# EAGLE design drawdio2 (EAGLE 5.01)
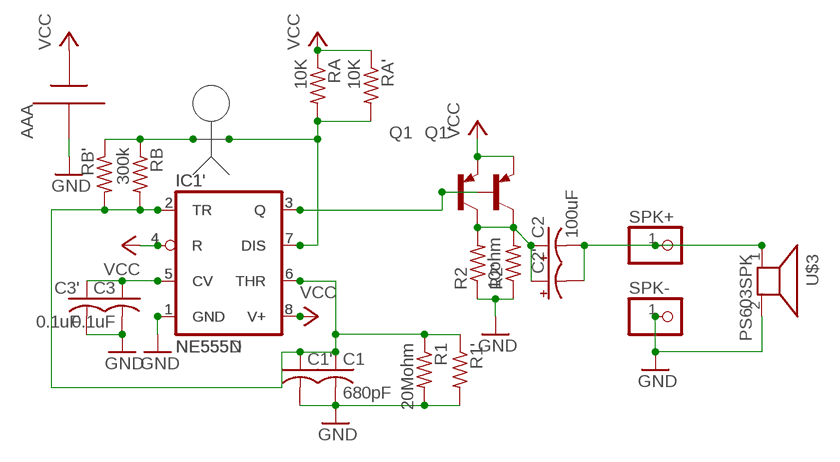
[diagram p0: schematic, sheet 1]

## Parts
AAA  AAA  [12BH412]
C1  680pF  C-US025-025X050  [C025-025X050]
C1'  C-USC1206  [C1206]
C2  100uF  CPOL-USE2.5-5  [E2,5-5]
C2'  CPOL-USB/3528-21W  [B/3528-21W]
C3  0.1uF  C-US025-025X050  [C025-025X050]
C3'  0.1uF  C-USC1206  [C1206]
IC1  NE555N  [DIL08]
IC1'  NE555D  [SO08]
Q1  MPS2907A-PNP-TO92-CBE  [TO92-CBE]
Q1'  MMBT2907ALT1-PNP-SOT23-BEC  [SOT23-BEC]
R1  20Mohm  R-US_0207/10  [0207/10]
R1'  R-US_R1206  [R1206]
R2  10ohm  R-US_0207/10  [0207/10]
R2'  R-US_M1206  [M1206]
RA  10K  R-US_0207/10  [0207/10]
RA'  10K  R-US_R1206  [R1206]
RB  300k  R-US_0207/10  [0207/10]
RB'  R-US_M1206  [M1206]
SPK+  PINHD-1X1  [1X01]
SPK-  PINHD-1X1  [1X01]
U$3  PS603SPK  [PS603]

## Nets
GND: AAA.- C1'.2 C1.2 C3'.2 C3.2 IC1'.1(GND) IC1.1(GND) R1'.2 R1.2 R2'.1 R2.1 SPK-.1 U$3.2
N$1: C3'.1 C3.1 IC1'.5(CV) IC1.5(CV)
N$2: IC1'.3(Q) IC1.3(Q) Q1'.B Q1.B
N$3: C2'.+ C2.+ Q1'.C Q1.C R2'.2 R2.2
N$4: C1'.1 C1.1 IC1'.2(TR) IC1'.6(THR) IC1.2(TR) IC1.6(THR) R1'.1 R1.1 RB'.2 RB.2
N$5: RB'.1 RB.1
N$6: IC1'.7(DIS) IC1.7(DIS) RA'.2 RA.2
N$7: C2'.- C2.- SPK+.1 U$3.1
VCC: AAA.+ IC1'.4(R) IC1'.8(V+) IC1.4(R) IC1.8(V+) Q1'.E Q1.E RA'.1 RA.1

## Library data of the parts
AAA = drawdio:AAA
C1 C1' C3 C3' = rcl-ez:C-US: CAPACITOR, American symbol
C2 C2' = rcl-ez:CPOL-US: POLARIZED CAPACITOR, American symbol
IC1 IC1' = drawdio:*555: TIMER
Q1 Q1' = transistor:*-PNP-: PNP Transistror
R1 R1' R2 R2' RA RA' RB RB' = rcl-ez:R-US_: RESISTOR, American symbol
SPK+ SPK- = ybox2:PINHD-1X1: PIN HEADER
U$3 = drawdio:PS603

## Board
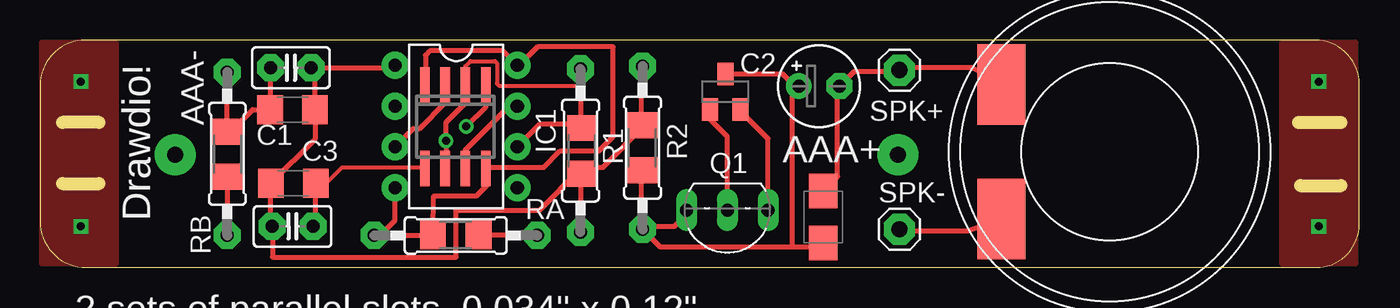
[diagram p1: board, top side]
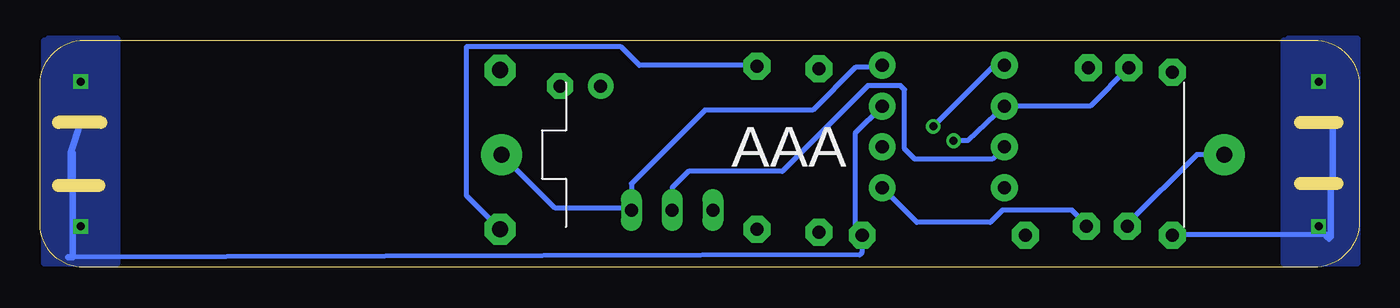
[diagram p2: board, bottom side, seen from below]

Size 82.15 x 14.15 mm. Coordinates in mm from the lower left corner, seen from the top.
Outline: 3.68,9.03 1.39,9.03
Outline: 1.39,5.22 3.68,5.22
Outline: 78.35,9.03 81.02,9.03
Outline: 78.48,5.09 81.02,5.09
Outline: 82.15,11.4 arc90 79.4,14.15 2.83,14.15 arc90 0,11.32 0,2.86 arc90 2.86,0 79.45,0 arc90 82.15,2.7 82.15,11.4
Copper layers (1*16): Top 0.035mm / dielectric 1.5mm / Bottom 0.035mm
Design rules "default": minimum track width 10mil, minimum drill 19mil, track to track 10mil, track to pad 10mil, pad to pad 10mil, via to via 10mil, smd to smd 0mil, copper to edge 0mil, drill to drill 8mil, minimum pad ring 10mil, minimum via ring 8mil, stop-mask expansion 4mil, vias tented up to drill 20mil, thermal gap 10mil

### Footprints (pad centres in the part's own frame; a part is rotated, then mirrored left to right if it is on the bottom)
12BH412 = drill 1 pad 2.54 round: + 22.5,0; - -22.5,0
C025-025X050 = drill 0.813 pad 1.676 octagon: 1 -1.27,0; 2 1.27,0
C1206 = smd 1.6 x 1.8: 1 -1.4,0; 2 1.4,0
E2,5-5 = drill 0.813 pad 1.6 round: + -1.27,0 | drill 0.813 pad 1.6 octagon: - 1.27,0
B/3528-21W = smd 2.15 x 1.8: + 1.625,0; - -1.625,0
DIL08 = drill 0.813 pad 1.676 round: 1 -3.81,-3.81; 2 -1.27,-3.81; 3 1.27,-3.81; 4 3.81,-3.81; 5 3.81,3.81; 6 1.27,3.81; 7 -1.27,3.81; 8 -3.81,3.81
SO08 = smd 0.6 x 2.2: 1 -1.905,-2.6; 2 -0.635,-2.6; 3 0.635,-2.6; 4 1.905,-2.6; 5 1.905,2.6; 6 0.635,2.6; 7 -0.635,2.6; 8 -1.905,2.6
TO92-CBE = drill 0.813 long: B 0,0; C 2.54,0; E -2.54,0
SOT23-BEC = smd 1 x 1.4: B -0.95,-1.1; C 0,1.1; E 0.95,-1.1
0207/10 = drill 0.813 pad 1.676 octagon: 1 -5.08,0; 2 5.08,0
R1206 = smd 1.6 x 1.803: 1 -1.422,0; 2 1.422,0
M1206 = smd 1.6 x 2: 1 -1.4,0; 2 1.4,0
1X01 = drill 1.016 pad 1.93 octagon: 1 0,0
PS603 = smd 5 x 3: 1 -4.184,-6.738; 2 4.184,-6.738

### Placement (x,y rotation side)
AAA  30.91,7.02 180 bottom
C1  15.62,12.43 0 top
C1'  15.72,9.82 0 top
C2  48.51,11.29 0 top
C2'  48.76,3.14 270 top
C3  15.72,2.55 180 top
C3'  15.77,5.25 180 top
IC1  25.9,8.78 270 top
IC1'  25.85,8.75 180 top
Q1  42.79,3.57 180 top
Q1'  42.67,10.93 0 top
R1  33.65,7.28 270 top
R1'  33.73,7.25 270 top
R2  37.51,7.46 270 top
R2'  37.49,7.46 270 top
RA  25.88,1.99 0 top
RA'  25.88,2.02 0 top
RB  11.65,7.07 90 top
RB'  11.68,7.05 90 top
SPK+  53.51,12.28 0 top
SPK-  53.51,2.38 0 top
U$3  66.59,7.2 270 top

### Tracks (layer width: path | path; a pad name or v marks a point on that pad's centre or on a via)
GND  (via drill 0.5)
  Top 0.305: IC1.1 22.22,12.46 22.2,12.43 C1.2 16.89,12.46 17.12,12.23 C1'.2 17.14,9.79 17.14,8.02 C3'.2 14.37,2.57 14.35,2.55 C3.2 14.47,2.55 14.47,0.65 25.9,0.65 25.9,3.57 31.08,3.57 33.65,6.13 | 33.65,2.3 R1.2 33.65,6.13 | 33.65,6.13 R1'.2 33.75,6.24 35.05,6.24 37.59,8.78 37.56,8.78 R2'.1 37.46,8.88 37.46,12.59 R2.1 | SPK-.1 53.59,2.17 53.46,2.3 57.78,2.3 U$3.2 | IC1'.1 27.76,9.99 v26.54,8.78
  Bottom 0.305: AAA.- 10.13,7.02 14.45,2.7 C3.2 14.35,2.55 | R1.2 33.65,2.3 | IC1.1 22.09,12.46 22.86,12.46 v26.54,8.78 | SPK-.1 55.62,4.48 55.62,13.73 45.97,13.73 44.83,12.59 37.56,12.59 R2.1
N$1
  Top 0.254: IC1'.5 23.86,6.24 18.79,6.24 17.78,5.22 17.14,5.22 | 17.14,5.22 16.89,5.22 | C3'.1 17.14,5.22
  Top 0.305: C3.1 17.14,2.55 17.17,2.58 C3'.1
  Bottom 0.305: IC1.5 27.55,2.81 22.98,2.81 22.22,3.57 17.9,3.57 17.14,2.81 17.14,2.55 C3.1
N$2
  Top 0.305: IC1.3 23.24,8.65 23.62,8.65 25.27,10.3 25.27,11.3 IC1'.3 | Q1.B 42.79,8.14 41.65,9.28 41.65,9.54 41.72,9.6 Q1'.B
  Bottom 0.305: IC1.3 22.86,6.74 27.68,6.74 28.32,7.38 28.32,11.06 28.57,11.32 30.6,11.32 35.94,5.98 41.78,5.98 42.79,4.97 Q1.B 42.79,3.44
N$3
  Top 0.305: 37.46,2.43 37.46,2.55 39.49,2.55 40.38,3.44 Q1.C | 37.46,2.43 R2.2 38.6,1.28 46.86,1.28 | R2'.2 37.46,6.03 37.46,2.43 | C2'.+ 48.53,1.28 46.86,1.28 | 46.86,1.28 46.86,10.91 C2.+ 47.21,11.29 47.11,11.19 46.27,12.03 Q1'.C
N$4  (via drill 0.5)
  Top 0.254: 25.27,6.24 25.22,6.18 IC1'.6 | IC1'.2 26.49,12.53 26.79,12.84 28.32,12.84 28.44,12.71 28.44,11.44 28.57,11.32 33.65,11.32
  Top 0.305: RB.2 11.65,9 11.55,8.9 11.68,8.78 RB'.2 11.75,8.45 11.81,8.39 13.23,9.82 C1'.1 14.32,9.89 14.35,9.92 C1.1 | R1.1 33.65,11.32 33.65,9.13 R1'.1 33.65,8.98 33.65,8.9 31.11,8.9 IC1.6 | IC1'.2 26.49,10.25 25.27,9.03 v25.27,7.89 25.27,6.24
  Bottom 0.305: C1.1 14.35,12.46 16.76,10.05 IC1.2 24.38,7.89 v25.27,7.89
N$5  (via drill 0.5)
  Top 0.305: RB.1 11.6,1.99 11.55,2.04 11.68,2.17 RB'.1
  Bottom 0.305: 11.7,2.04 11.81,2.04 | 11.7,2.04 RB.1 | 1.9,1.74 2.08,2.04 11.7,2.04
  Bottom 0.406: 2.03,1.92 2.08,2.04 1.77,1.92 1.77,5.09 | 1.77,5.09 1.77,5.35 1.65,5.35 1.65,7.38 | 1.77,5.09 1.9,5.09 | 1.9,5.09 2.41,5.09 | 1.9,5.09 1.65,5.09 1.65,7.38 | 2.15,8.9 1.65,9.03 1.65,7.38 | 1.65,7.38 1.65,7.07
  other vias: 2.54,11.57 2.54,2.55
  pour Top: 4.69,13.98 0.12,13.98 0.12,0.27 4.69,0.27
  pour Bottom: 4.44,14.24 0.12,14.24 0.12,0.27 4.69,0.27 4.69,14.11 4.31,14.11
N$6  (via drill 0.5)
  Top 0.305: 31.11,2.04 31.06,1.99 | IC1'.7 26.49,7.33 29.08,9.92 29.84,9.92 IC1.7 | 31.11,2.04 31.01,2.04 RA.2 | RA'.2 27.32,2.04 31.11,2.04
  Bottom 0.305: 80.39,0.65 31.11,0.77 30.98,0.9 30.98,2.02 | IC1.7 31.36,8.39 31.36,2.04 30.98,2.04 | 30.98,2.02 30.98,2.04 | 30.98,2.02 RA.2 30.96,2.04 30.98,2.04
  Bottom 0.406: 80.13,7.12 80.13,5.22 80.26,5.22 80.26,7.12 | 80.13,7.12 80.26,7.12 | 80.13,5.09 80.13,7.12 | 80.26,7.12 79.62,9.03 | 80.13,5.09 79.62,5.09 | 80.39,0.65 80.13,0.65 80.13,5.09
  other vias: 79.62,11.57 79.62,2.55
  pour Top: 81.91,13.98 77.34,13.98 77.34,0.27 81.91,0.27
  pour Bottom: 81.66,14.24 77.34,14.24 77.34,0.27 81.91,0.27 81.91,14.11 81.53,14.11
N$7
  Top 0.305: C2'.- 49.65,5.65 49.65,11.19 49.68,11.19 C2.- 50.69,12.2 53.46,12.2 53.46,12.23 SPK+.1 53.69,12.46 58.02,12.46 U$3.1
VCC
  Top 0.305: IC1.4 22.09,2.93 20.95,1.79 20.8,1.94 RA.1 24.3,1.99 24.46,1.84 | 24.46,1.84 24.51,1.79 | 24.46,1.84 RA'.1 24.46,2.25 24.51,4.46 27.17,4.46 27.81,5.09 27.81,6.36 27.76,6.31 | 24,11.3 24,10.93 | 24,11.3 IC1'.4 | 24,11.3 24,13.22 24.25,13.47 28.82,13.47 IC1.8 | 27.76,6.31 IC1'.8 | 27.76,6.31 27.83,6.24 31.36,6.24 32.38,7.25 34.79,7.25 35.68,8.14 35.68,13.73 30.98,13.73 29.71,12.46 IC1.8 | 43.56,9.66 43.62,9.73 Q1'.E 43.6,9.83 43.56,9.79 45.33,8.01 Q1.E | IC1.8 29.84,12.46
  Bottom 0.305: AAA.+ 50.08,3.7 45.33,3.7 Q1.E 45.33,5.22 40.76,9.79 34.03,9.79 31.36,12.46 29.71,12.46 IC1.8

### Text on the board
tPlace: Drawdio! | SPK+ | AAA- | AAA+ | SPK- | 2 sets of parallel slots, 0.034" x 0.12"
bDocu: Drawdio! | by jay silver | www.drawdio.com | kit design by adafruit | www.adafruit.com